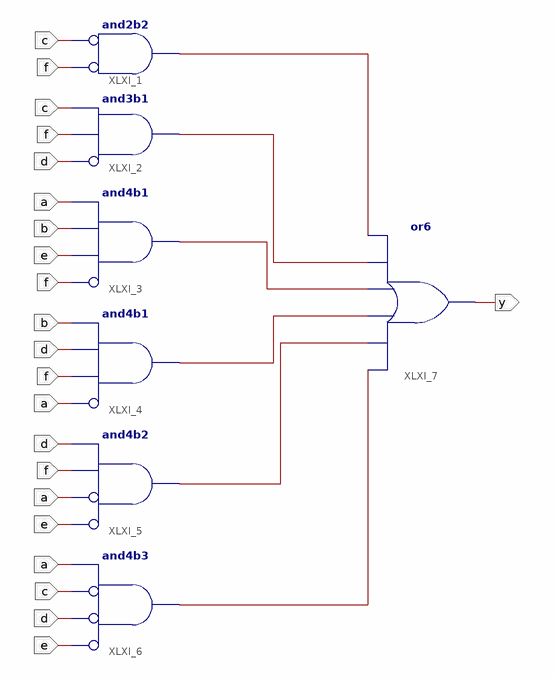
[diagram p0: schematic sheet 1]
// Xilinx ISE schematic gates_K_Map.sch (spartan6) as structural Verilog: 7 symbols, 7 ports
module gates_K_Map (
  input  a,
  input  b,
  input  c,
  input  d,
  input  e,
  input  f,
  output y
);

  wire XLXN_31, XLXN_32, XLXN_33, XLXN_34, XLXN_35, XLXN_36;

  and XLXI_1 (XLXN_31, ~f, ~c);  // and2b2
  and XLXI_2 (XLXN_32, ~d, f, c);  // and3b1
  and XLXI_3 (XLXN_33, ~f, e, b, a);  // and4b1
  and XLXI_4 (XLXN_34, ~a, f, d, b);  // and4b1
  and XLXI_5 (XLXN_35, ~e, ~a, f, d);  // and4b2
  and XLXI_6 (XLXN_36, ~e, ~d, ~c, a);  // and4b3
  or XLXI_7 (y, XLXN_36, XLXN_35, XLXN_34, XLXN_33, XLXN_32, XLXN_31);
endmodule
